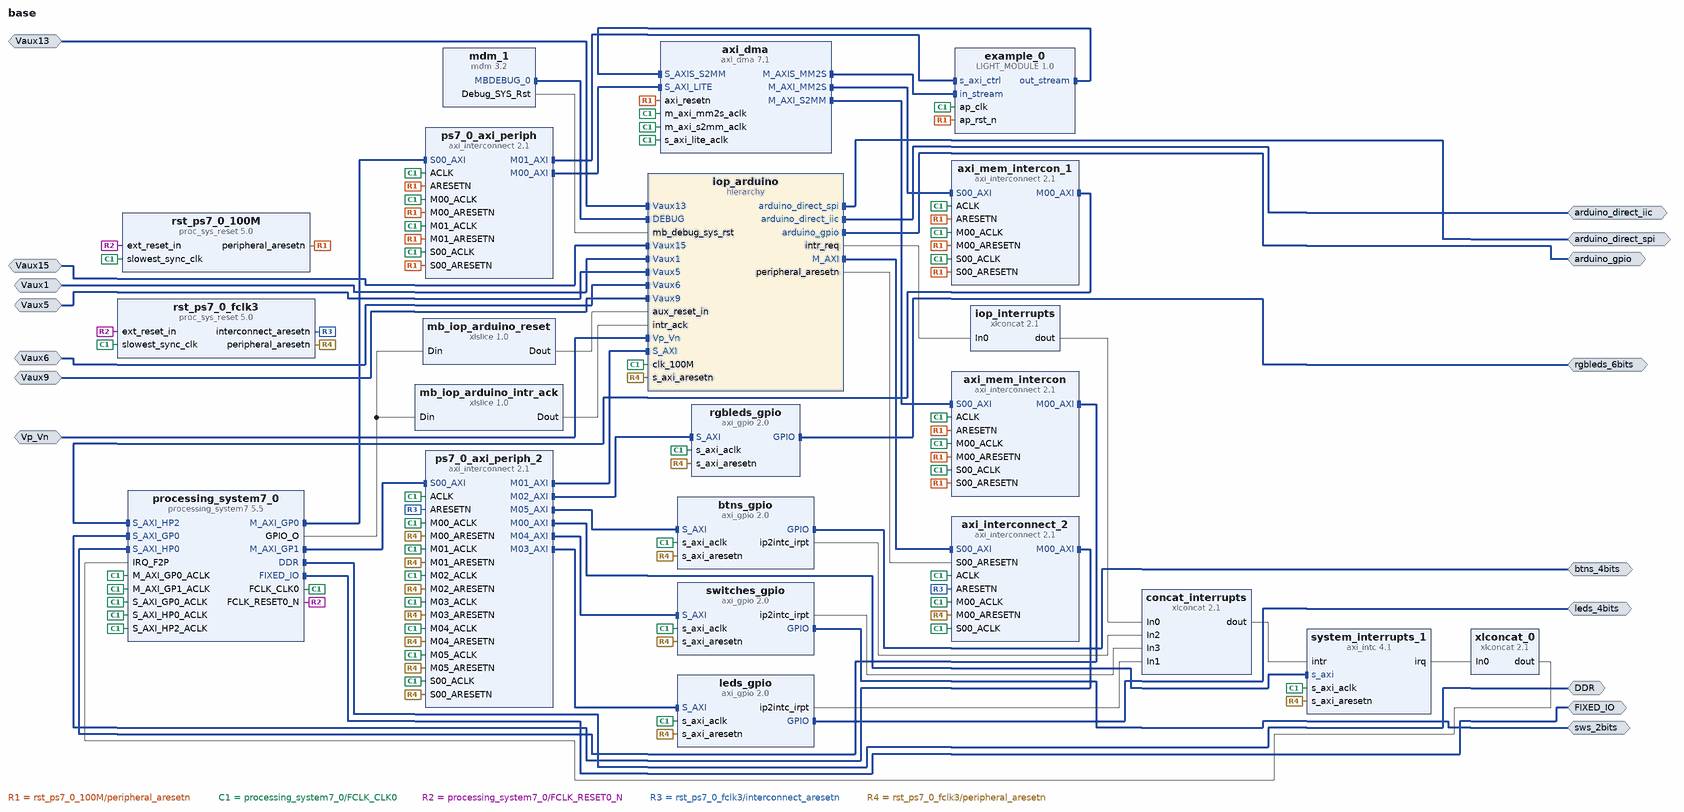
[diagram p0: block diagram of the top level]
# Vivado block design base, xc7z020clg400-1, Vivado 2023.1.1
create_bd_design base

create_bd_intf_port -mode Slave -vlnv xilinx.com:interface:diff_analog_io_rtl:1.0 Vaux1
create_bd_intf_port -mode Slave -vlnv xilinx.com:interface:diff_analog_io_rtl:1.0 Vaux5
create_bd_intf_port -mode Slave -vlnv xilinx.com:interface:diff_analog_io_rtl:1.0 Vaux6
create_bd_intf_port -mode Slave -vlnv xilinx.com:interface:diff_analog_io_rtl:1.0 Vaux9
create_bd_intf_port -mode Slave -vlnv xilinx.com:interface:diff_analog_io_rtl:1.0 Vaux13
create_bd_intf_port -mode Slave -vlnv xilinx.com:interface:diff_analog_io_rtl:1.0 Vaux15
create_bd_intf_port -mode Slave -vlnv xilinx.com:interface:diff_analog_io_rtl:1.0 Vp_Vn
create_bd_intf_port -mode Master -vlnv xilinx.com:interface:iic_rtl:1.0 arduino_direct_iic
create_bd_intf_port -mode Master -vlnv xilinx.com:interface:spi_rtl:1.0 arduino_direct_spi
create_bd_intf_port -mode Master -vlnv xilinx.com:interface:gpio_rtl:1.0 arduino_gpio
create_bd_intf_port -mode Master -vlnv xilinx.com:interface:gpio_rtl:1.0 btns_4bits
create_bd_intf_port -mode Master -vlnv xilinx.com:interface:gpio_rtl:1.0 leds_4bits
create_bd_intf_port -mode Master -vlnv xilinx.com:interface:gpio_rtl:1.0 rgbleds_6bits
create_bd_intf_port -mode Master -vlnv xilinx.com:interface:gpio_rtl:1.0 sws_2bits
create_bd_intf_port -mode Master -vlnv xilinx.com:interface:ddrx_rtl:1.0 DDR
create_bd_intf_port -mode Master -vlnv xilinx.com:display_processing_system7:fixedio_rtl:1.0 FIXED_IO

create_bd_cell -type ip -vlnv xilinx.com:ip:axi_interconnect:2.1 axi_interconnect_2
set_property -dict {CONFIG.NUM_MI 1 CONFIG.NUM_SI 1} [get_bd_cells axi_interconnect_2]
create_bd_cell -type ip -vlnv xilinx.com:ip:xlconcat:2.1 concat_interrupts
set_property -dict {CONFIG.NUM_PORTS 4} [get_bd_cells concat_interrupts]
create_bd_cell -type hier iop_arduino
create_bd_cell -type ip -vlnv xilinx.com:ip:xlconcat:2.1 iop_interrupts
set_property -dict {CONFIG.NUM_PORTS 1} [get_bd_cells iop_interrupts]
create_bd_cell -type ip -vlnv xilinx.com:ip:xlslice:1.0 mb_iop_arduino_intr_ack
set_property -dict [list \
  CONFIG.DIN_FROM 6 \
  CONFIG.DIN_TO 6 \
  CONFIG.DIN_WIDTH 10 \
  CONFIG.DOUT_WIDTH 1 \
] [get_bd_cells mb_iop_arduino_intr_ack]
create_bd_cell -type ip -vlnv xilinx.com:ip:xlslice:1.0 mb_iop_arduino_reset
set_property -dict {CONFIG.DIN_FROM 2 CONFIG.DIN_TO 2 CONFIG.DIN_WIDTH 10 CONFIG.DOUT_WIDTH 1} [get_bd_cells mb_iop_arduino_reset]
create_bd_cell -type ip -vlnv xilinx.com:ip:mdm:3.2 mdm_1
set_property -dict {CONFIG.C_ADDR_SIZE 32 CONFIG.C_MB_DBG_PORTS 1 CONFIG.C_M_AXI_ADDR_WIDTH 32} [get_bd_cells mdm_1]
create_bd_cell -type ip -vlnv xilinx.com:ip:axi_interconnect:2.1 ps7_0_axi_periph_2
set_property -dict [list \
  CONFIG.M00_HAS_REGSLICE 1 \
  CONFIG.M01_HAS_REGSLICE 1 \
  CONFIG.M02_HAS_REGSLICE 1 \
  CONFIG.M03_HAS_REGSLICE 1 \
  CONFIG.M04_HAS_REGSLICE 1 \
  CONFIG.M05_HAS_REGSLICE 1 \
  CONFIG.M06_HAS_REGSLICE 1 \
  CONFIG.M07_HAS_REGSLICE 1 \
  CONFIG.M08_HAS_REGSLICE 1 \
  CONFIG.M09_HAS_REGSLICE 1 \
  CONFIG.NUM_MI 6 \
  CONFIG.S00_HAS_REGSLICE 1 \
] [get_bd_cells ps7_0_axi_periph_2]
create_bd_cell -type ip -vlnv xilinx.com:ip:axi_intc:4.1 system_interrupts_1
create_bd_cell -type ip -vlnv xilinx.com:ip:xlconcat:2.1 xlconcat_0
set_property -dict {CONFIG.NUM_PORTS 16} [get_bd_cells xlconcat_0]
create_bd_cell -type ip -vlnv xilinx.com:ip:axi_dma:7.1 axi_dma
set_property -dict [list \
  CONFIG.c_include_sg 0 \
  CONFIG.c_m_axi_mm2s_data_width 64 \
  CONFIG.c_m_axis_mm2s_tdata_width 32 \
  CONFIG.c_mm2s_burst_size 16 \
  CONFIG.c_sg_length_width 26 \
] [get_bd_cells axi_dma]
create_bd_cell -type ip -vlnv xilinx.com:ip:axi_interconnect:2.1 axi_mem_intercon
set_property -dict {CONFIG.ENABLE_ADVANCED_OPTIONS 1 CONFIG.NUM_MI 1 CONFIG.XBAR_DATA_WIDTH 64} [get_bd_cells axi_mem_intercon]
create_bd_cell -type ip -vlnv xilinx.com:ip:axi_interconnect:2.1 axi_mem_intercon_1
set_property -dict {CONFIG.ENABLE_ADVANCED_OPTIONS 1 CONFIG.NUM_MI 1 CONFIG.XBAR_DATA_WIDTH 64} [get_bd_cells axi_mem_intercon_1]
create_bd_cell -type ip -vlnv xilinx.com:ip:axi_interconnect:2.1 ps7_0_axi_periph
set_property -dict {CONFIG.NUM_MI 2} [get_bd_cells ps7_0_axi_periph]
create_bd_cell -type ip -vlnv xilinx.com:ip:axi_gpio:2.0 btns_gpio
set_property -dict {CONFIG.C_ALL_INPUTS 1 CONFIG.C_GPIO_WIDTH 4 CONFIG.C_INTERRUPT_PRESENT 1} [get_bd_cells btns_gpio]
create_bd_cell -type ip -vlnv xilinx.com:ip:axi_gpio:2.0 leds_gpio
set_property -dict [list \
  CONFIG.C_ALL_OUTPUTS 1 \
  CONFIG.C_GPIO_WIDTH 4 \
  CONFIG.C_INTERRUPT_PRESENT 1 \
  CONFIG.C_IS_DUAL 0 \
] [get_bd_cells leds_gpio]
create_bd_cell -type ip -vlnv xilinx.com:ip:processing_system7:5.5 processing_system7_0
set_property -dict [list \
  CONFIG.PCW_APU_PERIPHERAL_FREQMHZ 650 \
  CONFIG.PCW_CRYSTAL_PERIPHERAL_FREQMHZ 50 \
  CONFIG.PCW_ENET0_ENET0_IO {MIO 16 .. 27} \
  CONFIG.PCW_ENET0_GRP_MDIO_ENABLE 1 \
  CONFIG.PCW_ENET0_GRP_MDIO_IO {MIO 52 .. 53} \
  CONFIG.PCW_ENET0_PERIPHERAL_ENABLE 1 \
  CONFIG.PCW_FPGA0_PERIPHERAL_FREQMHZ 100 \
  CONFIG.PCW_FPGA1_PERIPHERAL_FREQMHZ 142 \
  CONFIG.PCW_FPGA2_PERIPHERAL_FREQMHZ 200 \
  CONFIG.PCW_FPGA3_PERIPHERAL_FREQMHZ 100 \
  CONFIG.PCW_GPIO_EMIO_GPIO_ENABLE 1 \
  CONFIG.PCW_GPIO_EMIO_GPIO_IO 10 \
  CONFIG.PCW_GPIO_EMIO_GPIO_WIDTH 10 \
  CONFIG.PCW_GPIO_MIO_GPIO_ENABLE 0 \
  CONFIG.PCW_I2C0_GRP_INT_ENABLE 1 \
  CONFIG.PCW_I2C0_GRP_INT_IO EMIO \
  CONFIG.PCW_I2C0_I2C0_IO {MIO 50 .. 51} \
  CONFIG.PCW_I2C0_PERIPHERAL_ENABLE 1 \
  CONFIG.PCW_I2C_PERIPHERAL_FREQMHZ 108.333336 \
  CONFIG.PCW_IRQ_F2P_INTR 1 \
  CONFIG.PCW_PERIPHERAL_BOARD_PRESET None \
  CONFIG.PCW_PRESET_BANK1_VOLTAGE {LVCMOS 1.8V} \
  CONFIG.PCW_QSPI_GRP_FBCLK_ENABLE 1 \
  CONFIG.PCW_QSPI_GRP_FBCLK_IO {MIO 8} \
  CONFIG.PCW_QSPI_GRP_SINGLE_SS_ENABLE 1 \
  CONFIG.PCW_QSPI_GRP_SINGLE_SS_IO {MIO 1 .. 6} \
  CONFIG.PCW_QSPI_PERIPHERAL_ENABLE 1 \
  CONFIG.PCW_QSPI_QSPI_IO {MIO 1 .. 6} \
  CONFIG.PCW_SD0_GRP_CD_ENABLE 1 \
  CONFIG.PCW_SD0_GRP_CD_IO {MIO 47} \
  CONFIG.PCW_SD0_GRP_WP_ENABLE 0 \
  CONFIG.PCW_SD0_PERIPHERAL_ENABLE 1 \
  CONFIG.PCW_SD0_SD0_IO {MIO 40 .. 45} \
  CONFIG.PCW_SDIO_PERIPHERAL_FREQMHZ 50 \
  CONFIG.PCW_SINGLE_QSPI_DATA_MODE x4 \
  CONFIG.PCW_UART0_PERIPHERAL_ENABLE 1 \
  CONFIG.PCW_UART0_UART0_IO {MIO 14 .. 15} \
  CONFIG.PCW_UART1_PERIPHERAL_ENABLE 0 \
  CONFIG.PCW_UART_PERIPHERAL_FREQMHZ 100 \
  CONFIG.PCW_UIPARAM_DDR_BUS_WIDTH {16 Bit} \
  CONFIG.PCW_UIPARAM_DDR_FREQ_MHZ 525 \
  CONFIG.PCW_UIPARAM_DDR_PARTNO Custom \
  CONFIG.PCW_USB0_PERIPHERAL_ENABLE 0 \
  CONFIG.PCW_USE_FABRIC_INTERRUPT 1 \
  CONFIG.PCW_USE_M_AXI_GP1 1 \
  CONFIG.PCW_USE_S_AXI_GP0 1 \
  CONFIG.PCW_USE_S_AXI_HP0 1 \
  CONFIG.PCW_USE_S_AXI_HP2 1 \
] [get_bd_cells processing_system7_0]
# 451 more settings of processing_system7_0 are not shown: defaults, MIO pin electricals, DDR timing, and values the tool derives
create_bd_cell -type ip -vlnv xilinx.com:ip:axi_gpio:2.0 rgbleds_gpio
set_property -dict {CONFIG.C_ALL_OUTPUTS 1 CONFIG.C_GPIO_WIDTH 6} [get_bd_cells rgbleds_gpio]
create_bd_cell -type ip -vlnv xilinx.com:ip:proc_sys_reset:5.0 rst_ps7_0_100M
create_bd_cell -type ip -vlnv xilinx.com:ip:proc_sys_reset:5.0 rst_ps7_0_fclk3
create_bd_cell -type ip -vlnv xilinx.com:ip:axi_gpio:2.0 switches_gpio
set_property -dict [list \
  CONFIG.C_ALL_INPUTS 1 \
  CONFIG.C_GPIO_WIDTH 2 \
  CONFIG.C_INTERRUPT_PRESENT 1 \
  CONFIG.C_IS_DUAL 0 \
] [get_bd_cells switches_gpio]
create_bd_cell -type ip -vlnv xilinx.com:hls:LIGHT_MODULE:1.0 example_0

# ---- hierarchy /iop_arduino ----
current_bd_instance /iop_arduino
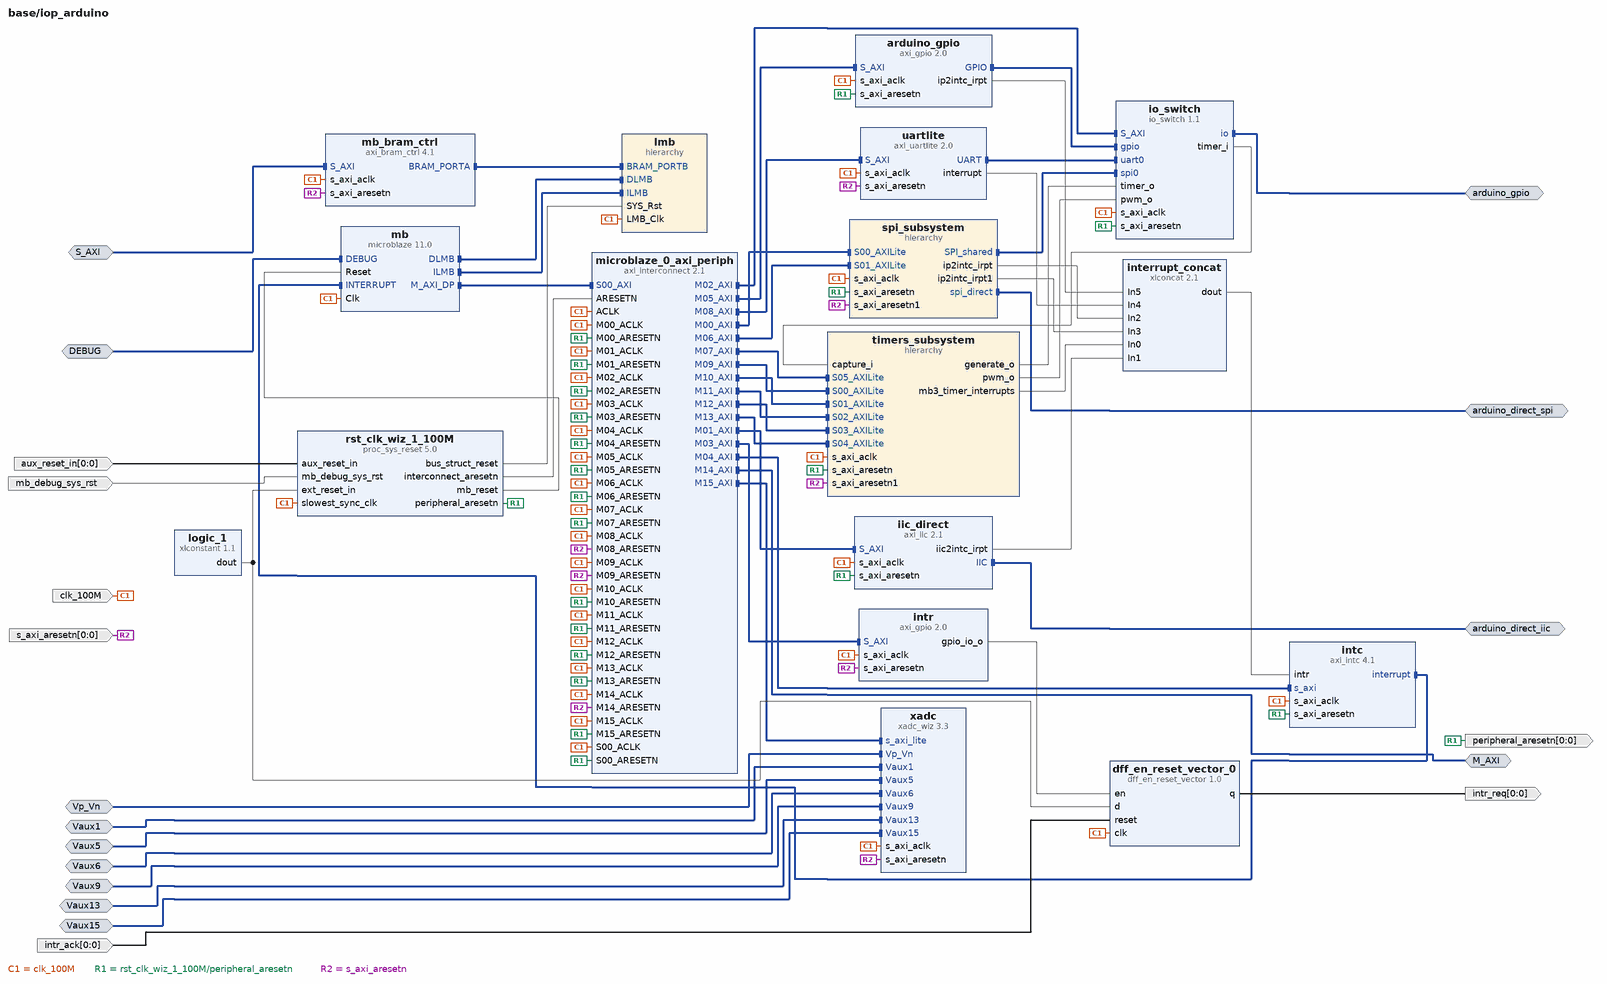
[diagram p1: block diagram inside /iop_arduino]
create_bd_intf_pin -mode Slave -vlnv xilinx.com:interface:mbdebug_rtl:3.0 DEBUG
create_bd_intf_pin -mode Slave -vlnv xilinx.com:interface:aximm_rtl:1.0 S_AXI
create_bd_intf_pin -mode Slave -vlnv xilinx.com:interface:diff_analog_io_rtl:1.0 Vaux1
create_bd_intf_pin -mode Slave -vlnv xilinx.com:interface:diff_analog_io_rtl:1.0 Vaux5
create_bd_intf_pin -mode Slave -vlnv xilinx.com:interface:diff_analog_io_rtl:1.0 Vaux6
create_bd_intf_pin -mode Slave -vlnv xilinx.com:interface:diff_analog_io_rtl:1.0 Vaux9
create_bd_intf_pin -mode Slave -vlnv xilinx.com:interface:diff_analog_io_rtl:1.0 Vaux13
create_bd_intf_pin -mode Slave -vlnv xilinx.com:interface:diff_analog_io_rtl:1.0 Vaux15
create_bd_intf_pin -mode Slave -vlnv xilinx.com:interface:diff_analog_io_rtl:1.0 Vp_Vn
create_bd_intf_pin -mode Master -vlnv xilinx.com:interface:iic_rtl:1.0 arduino_direct_iic
create_bd_intf_pin -mode Master -vlnv xilinx.com:interface:spi_rtl:1.0 arduino_direct_spi
create_bd_intf_pin -mode Master -vlnv xilinx.com:interface:gpio_rtl:1.0 arduino_gpio
create_bd_intf_pin -mode Master -vlnv xilinx.com:interface:aximm_rtl:1.0 M_AXI
create_bd_pin -dir I -from 0 -to 0 -type rst aux_reset_in
create_bd_pin -dir I -type clk clk_100M
create_bd_pin -dir I -from 0 -to 0 intr_ack
create_bd_pin -dir O -from 0 -to 0 intr_req
create_bd_pin -dir I -type rst mb_debug_sys_rst
create_bd_pin -dir O -from 0 -to 0 -type rst peripheral_aresetn
create_bd_pin -dir I -from 0 -to 0 -type rst s_axi_aresetn

create_bd_cell -type ip -vlnv xilinx.com:user:dff_en_reset_vector:1.0 dff_en_reset_vector_0
set_property -dict {CONFIG.SIZE 1} [get_bd_cells dff_en_reset_vector_0]
create_bd_cell -type ip -vlnv xilinx.com:ip:axi_intc:4.1 intc
create_bd_cell -type ip -vlnv xilinx.com:ip:xlconcat:2.1 interrupt_concat
set_property -dict {CONFIG.NUM_PORTS 6} [get_bd_cells interrupt_concat]
create_bd_cell -type ip -vlnv xilinx.com:user:io_switch:1.1 io_switch
set_property -dict [list \
  CONFIG.C_INTERFACE_TYPE 3 \
  CONFIG.C_IO_SWITCH_WIDTH 20 \
  CONFIG.I2C0_Enable false \
  CONFIG.PWM_Enable true \
  CONFIG.SPI0_Enable true \
  CONFIG.SPI1_Enable false \
  CONFIG.Timer_Enable true \
  CONFIG.UART0_Enable true \
] [get_bd_cells io_switch]
create_bd_cell -type hier lmb
create_bd_cell -type ip -vlnv xilinx.com:ip:xlconstant:1.1 logic_1
create_bd_cell -type ip -vlnv xilinx.com:ip:microblaze:11.0 mb
set_property -dict {CONFIG.C_DEBUG_ENABLED 1 CONFIG.C_D_AXI 1 CONFIG.C_D_LMB 1 CONFIG.C_I_LMB 1} [get_bd_cells mb]
create_bd_cell -type ip -vlnv xilinx.com:ip:axi_bram_ctrl:4.1 mb_bram_ctrl
set_property -dict {CONFIG.SINGLE_PORT_BRAM 1} [get_bd_cells mb_bram_ctrl]
create_bd_cell -type hier spi_subsystem
create_bd_cell -type hier timers_subsystem
create_bd_cell -type ip -vlnv xilinx.com:ip:xadc_wiz:3.3 xadc
set_property -dict [list \
  CONFIG.AVERAGE_ENABLE_TEMPERATURE true \
  CONFIG.AVERAGE_ENABLE_VAUXP0_VAUXN0 false \
  CONFIG.AVERAGE_ENABLE_VAUXP12_VAUXN12 false \
  CONFIG.AVERAGE_ENABLE_VAUXP13_VAUXN13 true \
  CONFIG.AVERAGE_ENABLE_VAUXP15_VAUXN15 true \
  CONFIG.AVERAGE_ENABLE_VAUXP1_VAUXN1 true \
  CONFIG.AVERAGE_ENABLE_VAUXP5_VAUXN5 true \
  CONFIG.AVERAGE_ENABLE_VAUXP6_VAUXN6 true \
  CONFIG.AVERAGE_ENABLE_VAUXP8_VAUXN8 false \
  CONFIG.AVERAGE_ENABLE_VAUXP9_VAUXN9 true \
  CONFIG.AVERAGE_ENABLE_VP_VN true \
  CONFIG.BIPOLAR_VAUXP0_VAUXN0 false \
  CONFIG.BIPOLAR_VAUXP12_VAUXN12 false \
  CONFIG.BIPOLAR_VAUXP8_VAUXN8 false \
  CONFIG.CHANNEL_AVERAGING 16 \
  CONFIG.CHANNEL_ENABLE_TEMPERATURE true \
  CONFIG.CHANNEL_ENABLE_VAUXP0_VAUXN0 false \
  CONFIG.CHANNEL_ENABLE_VAUXP12_VAUXN12 false \
  CONFIG.CHANNEL_ENABLE_VAUXP13_VAUXN13 true \
  CONFIG.CHANNEL_ENABLE_VAUXP15_VAUXN15 true \
  CONFIG.CHANNEL_ENABLE_VAUXP1_VAUXN1 true \
  CONFIG.CHANNEL_ENABLE_VAUXP5_VAUXN5 true \
  CONFIG.CHANNEL_ENABLE_VAUXP6_VAUXN6 true \
  CONFIG.CHANNEL_ENABLE_VAUXP8_VAUXN8 false \
  CONFIG.CHANNEL_ENABLE_VAUXP9_VAUXN9 true \
  CONFIG.CHANNEL_ENABLE_VP_VN true \
  CONFIG.CHANNEL_ENABLE_VREFN false \
  CONFIG.CHANNEL_ENABLE_VREFP false \
  CONFIG.ENABLE_RESET false \
  CONFIG.ENABLE_VCCDDRO_ALARM false \
  CONFIG.ENABLE_VCCPAUX_ALARM false \
  CONFIG.ENABLE_VCCPINT_ALARM false \
  CONFIG.EXTERNAL_MUX_CHANNEL VP_VN \
  CONFIG.INTERFACE_SELECTION Enable_AXI \
  CONFIG.OT_ALARM false \
  CONFIG.SEQUENCER_MODE Continuous \
  CONFIG.SINGLE_CHANNEL_SELECTION TEMPERATURE \
  CONFIG.USER_TEMP_ALARM false \
  CONFIG.VCCAUX_ALARM false \
  CONFIG.VCCINT_ALARM false \
  CONFIG.XADC_STARUP_SELECTION channel_sequencer \
] [get_bd_cells xadc]
create_bd_cell -type ip -vlnv xilinx.com:ip:axi_interconnect:2.1 microblaze_0_axi_periph
set_property -dict [list \
  CONFIG.M00_HAS_REGSLICE 1 \
  CONFIG.M01_HAS_REGSLICE 1 \
  CONFIG.M02_HAS_REGSLICE 1 \
  CONFIG.M03_HAS_REGSLICE 1 \
  CONFIG.M04_HAS_REGSLICE 1 \
  CONFIG.M05_HAS_REGSLICE 1 \
  CONFIG.M06_HAS_REGSLICE 1 \
  CONFIG.M07_HAS_REGSLICE 1 \
  CONFIG.M08_HAS_REGSLICE 1 \
  CONFIG.M09_HAS_REGSLICE 1 \
  CONFIG.M10_HAS_REGSLICE 1 \
  CONFIG.M11_HAS_REGSLICE 1 \
  CONFIG.M12_HAS_REGSLICE 1 \
  CONFIG.M13_HAS_REGSLICE 1 \
  CONFIG.M14_HAS_REGSLICE 1 \
  CONFIG.M15_HAS_REGSLICE 1 \
  CONFIG.M16_HAS_REGSLICE 1 \
  CONFIG.NUM_MI 16 \
  CONFIG.S00_HAS_REGSLICE 1 \
] [get_bd_cells microblaze_0_axi_periph]
create_bd_cell -type ip -vlnv xilinx.com:ip:axi_gpio:2.0 arduino_gpio
set_property -dict {CONFIG.C_GPIO_WIDTH 20 CONFIG.C_INTERRUPT_PRESENT 1 CONFIG.C_IS_DUAL 0} [get_bd_cells arduino_gpio]
create_bd_cell -type ip -vlnv xilinx.com:ip:axi_iic:2.1 iic_direct
create_bd_cell -type ip -vlnv xilinx.com:ip:axi_gpio:2.0 intr
set_property -dict {CONFIG.C_ALL_OUTPUTS 1 CONFIG.C_GPIO_WIDTH 1} [get_bd_cells intr]
create_bd_cell -type ip -vlnv xilinx.com:ip:proc_sys_reset:5.0 rst_clk_wiz_1_100M
set_property -dict {CONFIG.C_AUX_RESET_HIGH 1} [get_bd_cells rst_clk_wiz_1_100M]
create_bd_cell -type ip -vlnv xilinx.com:ip:axi_uartlite:2.0 uartlite
set_property -dict {CONFIG.C_BAUDRATE 9600} [get_bd_cells uartlite]

# ---- hierarchy /iop_arduino/lmb ----
current_bd_instance /iop_arduino/lmb
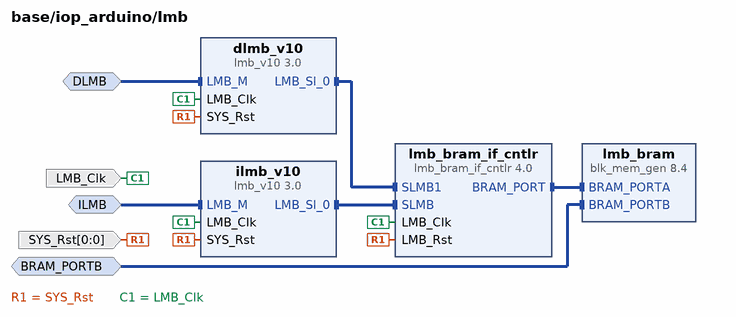
[diagram p2: block diagram inside /iop_arduino/lmb]
create_bd_intf_pin -mode Slave -vlnv xilinx.com:interface:bram_rtl:1.0 BRAM_PORTB
create_bd_intf_pin -mode MirroredMaster -vlnv xilinx.com:interface:lmb_rtl:1.0 DLMB
create_bd_intf_pin -mode MirroredMaster -vlnv xilinx.com:interface:lmb_rtl:1.0 ILMB
create_bd_pin -dir I -type clk LMB_Clk
create_bd_pin -dir I -from 0 -to 0 -type rst SYS_Rst

create_bd_cell -type ip -vlnv xilinx.com:ip:lmb_v10:3.0 dlmb_v10
create_bd_cell -type ip -vlnv xilinx.com:ip:lmb_v10:3.0 ilmb_v10
create_bd_cell -type ip -vlnv xilinx.com:ip:blk_mem_gen:8.4 lmb_bram
set_property -dict [list \
  CONFIG.Enable_B Use_ENB_Pin \
  CONFIG.Memory_Type True_Dual_Port_RAM \
  CONFIG.Port_B_Clock 100 \
  CONFIG.Port_B_Enable_Rate 100 \
  CONFIG.Port_B_Write_Rate 50 \
  CONFIG.Use_RSTB_Pin true \
  CONFIG.use_bram_block BRAM_Controller \
] [get_bd_cells lmb_bram]
create_bd_cell -type ip -vlnv xilinx.com:ip:lmb_bram_if_cntlr:4.0 lmb_bram_if_cntlr
set_property -dict {CONFIG.C_ECC 0 CONFIG.C_NUM_LMB 2} [get_bd_cells lmb_bram_if_cntlr]

# ---- hierarchy /iop_arduino/spi_subsystem ----
current_bd_instance /iop_arduino/spi_subsystem
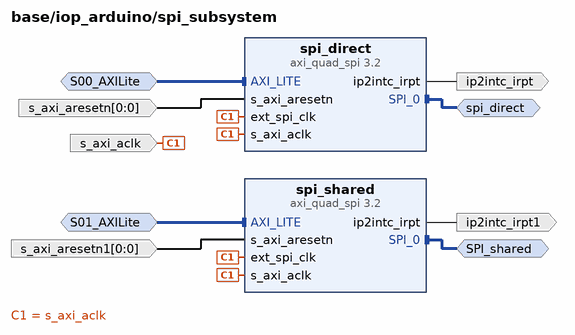
[diagram p3: block diagram inside /iop_arduino/spi_subsystem]
create_bd_intf_pin -mode Slave -vlnv xilinx.com:interface:aximm_rtl:1.0 S00_AXILite
create_bd_intf_pin -mode Slave -vlnv xilinx.com:interface:aximm_rtl:1.0 S01_AXILite
create_bd_intf_pin -mode Master -vlnv xilinx.com:interface:spi_rtl:1.0 SPI_shared
create_bd_intf_pin -mode Master -vlnv xilinx.com:interface:spi_rtl:1.0 spi_direct
create_bd_pin -dir O -type intr ip2intc_irpt
create_bd_pin -dir O -type intr ip2intc_irpt1
create_bd_pin -dir I -type clk s_axi_aclk
create_bd_pin -dir I -from 0 -to 0 -type rst s_axi_aresetn
create_bd_pin -dir I -from 0 -to 0 -type rst s_axi_aresetn1

create_bd_cell -type ip -vlnv xilinx.com:ip:axi_quad_spi:3.2 spi_direct
set_property -dict {CONFIG.C_USE_STARTUP 0} [get_bd_cells spi_direct]
create_bd_cell -type ip -vlnv xilinx.com:ip:axi_quad_spi:3.2 spi_shared
set_property -dict {CONFIG.C_USE_STARTUP 0} [get_bd_cells spi_shared]

# ---- hierarchy /iop_arduino/timers_subsystem ----
current_bd_instance /iop_arduino/timers_subsystem
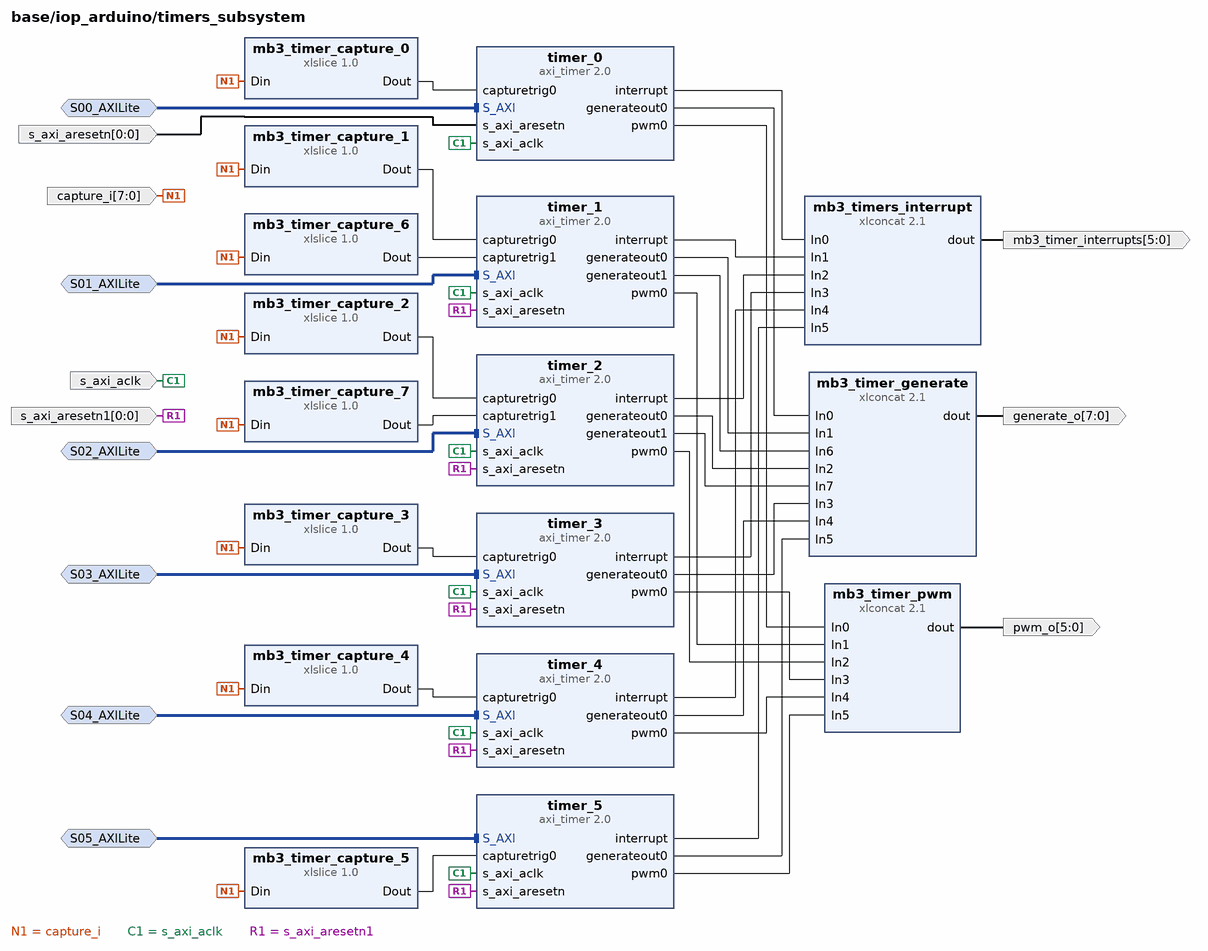
[diagram p4: block diagram inside /iop_arduino/timers_subsystem]
create_bd_intf_pin -mode Slave -vlnv xilinx.com:interface:aximm_rtl:1.0 S00_AXILite
create_bd_intf_pin -mode Slave -vlnv xilinx.com:interface:aximm_rtl:1.0 S01_AXILite
create_bd_intf_pin -mode Slave -vlnv xilinx.com:interface:aximm_rtl:1.0 S02_AXILite
create_bd_intf_pin -mode Slave -vlnv xilinx.com:interface:aximm_rtl:1.0 S03_AXILite
create_bd_intf_pin -mode Slave -vlnv xilinx.com:interface:aximm_rtl:1.0 S04_AXILite
create_bd_intf_pin -mode Slave -vlnv xilinx.com:interface:aximm_rtl:1.0 S05_AXILite
create_bd_pin -dir I -from 7 -to 0 capture_i
create_bd_pin -dir O -from 7 -to 0 generate_o
create_bd_pin -dir O -from 5 -to 0 mb3_timer_interrupts
create_bd_pin -dir O -from 5 -to 0 pwm_o
create_bd_pin -dir I -type clk s_axi_aclk
create_bd_pin -dir I -from 0 -to 0 -type rst s_axi_aresetn
create_bd_pin -dir I -from 0 -to 0 -type rst s_axi_aresetn1

create_bd_cell -type ip -vlnv xilinx.com:ip:xlslice:1.0 mb3_timer_capture_0
set_property -dict {CONFIG.DIN_FROM 0 CONFIG.DIN_TO 0 CONFIG.DIN_WIDTH 8} [get_bd_cells mb3_timer_capture_0]
create_bd_cell -type ip -vlnv xilinx.com:ip:xlslice:1.0 mb3_timer_capture_1
set_property -dict {CONFIG.DIN_FROM 1 CONFIG.DIN_TO 1 CONFIG.DIN_WIDTH 8 CONFIG.DOUT_WIDTH 1} [get_bd_cells mb3_timer_capture_1]
create_bd_cell -type ip -vlnv xilinx.com:ip:xlslice:1.0 mb3_timer_capture_2
set_property -dict {CONFIG.DIN_FROM 2 CONFIG.DIN_TO 2 CONFIG.DIN_WIDTH 8 CONFIG.DOUT_WIDTH 1} [get_bd_cells mb3_timer_capture_2]
create_bd_cell -type ip -vlnv xilinx.com:ip:xlslice:1.0 mb3_timer_capture_3
set_property -dict {CONFIG.DIN_FROM 3 CONFIG.DIN_TO 3 CONFIG.DIN_WIDTH 8 CONFIG.DOUT_WIDTH 1} [get_bd_cells mb3_timer_capture_3]
create_bd_cell -type ip -vlnv xilinx.com:ip:xlslice:1.0 mb3_timer_capture_4
set_property -dict {CONFIG.DIN_FROM 4 CONFIG.DIN_TO 4 CONFIG.DIN_WIDTH 8 CONFIG.DOUT_WIDTH 1} [get_bd_cells mb3_timer_capture_4]
create_bd_cell -type ip -vlnv xilinx.com:ip:xlslice:1.0 mb3_timer_capture_5
set_property -dict {CONFIG.DIN_FROM 5 CONFIG.DIN_TO 5 CONFIG.DIN_WIDTH 8 CONFIG.DOUT_WIDTH 1} [get_bd_cells mb3_timer_capture_5]
create_bd_cell -type ip -vlnv xilinx.com:ip:xlslice:1.0 mb3_timer_capture_6
set_property -dict {CONFIG.DIN_FROM 6 CONFIG.DIN_TO 6 CONFIG.DIN_WIDTH 8 CONFIG.DOUT_WIDTH 1} [get_bd_cells mb3_timer_capture_6]
create_bd_cell -type ip -vlnv xilinx.com:ip:xlslice:1.0 mb3_timer_capture_7
set_property -dict {CONFIG.DIN_FROM 7 CONFIG.DIN_TO 7 CONFIG.DIN_WIDTH 8 CONFIG.DOUT_WIDTH 1} [get_bd_cells mb3_timer_capture_7]
create_bd_cell -type ip -vlnv xilinx.com:ip:xlconcat:2.1 mb3_timer_generate
set_property -dict {CONFIG.NUM_PORTS 8} [get_bd_cells mb3_timer_generate]
create_bd_cell -type ip -vlnv xilinx.com:ip:xlconcat:2.1 mb3_timer_pwm
set_property -dict {CONFIG.NUM_PORTS 6} [get_bd_cells mb3_timer_pwm]
create_bd_cell -type ip -vlnv xilinx.com:ip:xlconcat:2.1 mb3_timers_interrupt
set_property -dict {CONFIG.NUM_PORTS 6} [get_bd_cells mb3_timers_interrupt]
create_bd_cell -type ip -vlnv xilinx.com:ip:axi_timer:2.0 timer_0
create_bd_cell -type ip -vlnv xilinx.com:ip:axi_timer:2.0 timer_1
create_bd_cell -type ip -vlnv xilinx.com:ip:axi_timer:2.0 timer_2
create_bd_cell -type ip -vlnv xilinx.com:ip:axi_timer:2.0 timer_3
create_bd_cell -type ip -vlnv xilinx.com:ip:axi_timer:2.0 timer_4
create_bd_cell -type ip -vlnv xilinx.com:ip:axi_timer:2.0 timer_5

# ---- connections ----

current_bd_instance /iop_arduino
connect_bd_intf_net [get_bd_intf_pins lmb/BRAM_PORTB] [get_bd_intf_pins mb_bram_ctrl/BRAM_PORTA]
connect_bd_intf_net [get_bd_intf_pins arduino_direct_iic] [get_bd_intf_pins iic_direct/IIC]
connect_bd_intf_net [get_bd_intf_pins S_AXI] [get_bd_intf_pins mb_bram_ctrl/S_AXI]
connect_bd_intf_net [get_bd_intf_pins arduino_gpio] [get_bd_intf_pins io_switch/io]
connect_bd_intf_net [get_bd_intf_pins Vp_Vn] [get_bd_intf_pins xadc/Vp_Vn]
connect_bd_intf_net [get_bd_intf_pins Vaux1] [get_bd_intf_pins xadc/Vaux1]
connect_bd_intf_net [get_bd_intf_pins Vaux5] [get_bd_intf_pins xadc/Vaux5]
connect_bd_intf_net [get_bd_intf_pins Vaux6] [get_bd_intf_pins xadc/Vaux6]
connect_bd_intf_net [get_bd_intf_pins Vaux9] [get_bd_intf_pins xadc/Vaux9]
connect_bd_intf_net [get_bd_intf_pins Vaux13] [get_bd_intf_pins xadc/Vaux13]
connect_bd_intf_net [get_bd_intf_pins Vaux15] [get_bd_intf_pins xadc/Vaux15]
connect_bd_intf_net [get_bd_intf_pins arduino_gpio/GPIO] [get_bd_intf_pins io_switch/gpio]
connect_bd_intf_net -intf_net mb3_intc_interrupt [get_bd_intf_pins intc/interrupt] [get_bd_intf_pins mb/INTERRUPT]
connect_bd_intf_net -intf_net mb3_spi_subsystem_spi_sw_shield [get_bd_intf_pins arduino_direct_spi] [get_bd_intf_pins spi_subsystem/spi_direct]
connect_bd_intf_net -intf_net microblaze_0_M_AXI_DP [get_bd_intf_pins mb/M_AXI_DP] [get_bd_intf_pins microblaze_0_axi_periph/S00_AXI]
connect_bd_intf_net [get_bd_intf_pins microblaze_0_axi_periph/M00_AXI] [get_bd_intf_pins spi_subsystem/S00_AXILite]
connect_bd_intf_net [get_bd_intf_pins iic_direct/S_AXI] [get_bd_intf_pins microblaze_0_axi_periph/M01_AXI]
connect_bd_intf_net [get_bd_intf_pins io_switch/S_AXI] [get_bd_intf_pins microblaze_0_axi_periph/M02_AXI]
connect_bd_intf_net [get_bd_intf_pins intr/S_AXI] [get_bd_intf_pins microblaze_0_axi_periph/M03_AXI]
connect_bd_intf_net [get_bd_intf_pins intc/s_axi] [get_bd_intf_pins microblaze_0_axi_periph/M04_AXI]
connect_bd_intf_net [get_bd_intf_pins arduino_gpio/S_AXI] [get_bd_intf_pins microblaze_0_axi_periph/M05_AXI]
connect_bd_intf_net [get_bd_intf_pins microblaze_0_axi_periph/M06_AXI] [get_bd_intf_pins spi_subsystem/S01_AXILite]
connect_bd_intf_net [get_bd_intf_pins microblaze_0_axi_periph/M07_AXI] [get_bd_intf_pins timers_subsystem/S05_AXILite]
connect_bd_intf_net [get_bd_intf_pins microblaze_0_axi_periph/M08_AXI] [get_bd_intf_pins uartlite/S_AXI]
connect_bd_intf_net [get_bd_intf_pins microblaze_0_axi_periph/M09_AXI] [get_bd_intf_pins timers_subsystem/S00_AXILite]
connect_bd_intf_net [get_bd_intf_pins microblaze_0_axi_periph/M10_AXI] [get_bd_intf_pins timers_subsystem/S01_AXILite]
connect_bd_intf_net [get_bd_intf_pins microblaze_0_axi_periph/M11_AXI] [get_bd_intf_pins timers_subsystem/S02_AXILite]
connect_bd_intf_net [get_bd_intf_pins microblaze_0_axi_periph/M12_AXI] [get_bd_intf_pins timers_subsystem/S03_AXILite]
connect_bd_intf_net [get_bd_intf_pins microblaze_0_axi_periph/M13_AXI] [get_bd_intf_pins timers_subsystem/S04_AXILite]
connect_bd_intf_net [get_bd_intf_pins M_AXI] [get_bd_intf_pins microblaze_0_axi_periph/M14_AXI]
connect_bd_intf_net [get_bd_intf_pins microblaze_0_axi_periph/M15_AXI] [get_bd_intf_pins xadc/s_axi_lite]
connect_bd_intf_net -intf_net microblaze_0_debug [get_bd_intf_pins DEBUG] [get_bd_intf_pins mb/DEBUG]
connect_bd_intf_net -intf_net microblaze_0_dlmb_1 [get_bd_intf_pins lmb/DLMB] [get_bd_intf_pins mb/DLMB]
connect_bd_intf_net -intf_net microblaze_0_ilmb_1 [get_bd_intf_pins lmb/ILMB] [get_bd_intf_pins mb/ILMB]
connect_bd_intf_net -intf_net spi_subsystem_SPI_0 [get_bd_intf_pins io_switch/spi0] [get_bd_intf_pins spi_subsystem/SPI_shared]
connect_bd_intf_net [get_bd_intf_pins io_switch/uart0] [get_bd_intf_pins uartlite/UART]
connect_bd_net -net capture_i_1 [get_bd_pins io_switch/timer_i] [get_bd_pins timers_subsystem/capture_i]
connect_bd_net [get_bd_pins dff_en_reset_vector_0/q] [get_bd_pins intr_req]
connect_bd_net [get_bd_pins logic_1/dout] [get_bd_pins dff_en_reset_vector_0/d] [get_bd_pins rst_clk_wiz_1_100M/ext_reset_in]
connect_bd_net -net mb3_concat_dout [get_bd_pins interrupt_concat/dout] [get_bd_pins intc/intr]
connect_bd_net -net mb3_gpio_subsystem_ip2intc_irpt [get_bd_pins arduino_gpio/ip2intc_irpt] [get_bd_pins interrupt_concat/In5]
connect_bd_net -net mb3_iic_subsystem_iic2intc_irpt [get_bd_pins iic_direct/iic2intc_irpt] [get_bd_pins interrupt_concat/In1]
connect_bd_net -net mb3_intr_ack_1 [get_bd_pins intr_ack] [get_bd_pins dff_en_reset_vector_0/reset]
connect_bd_net -net mb3_intr_gpio_io_o [get_bd_pins intr/gpio_io_o] [get_bd_pins dff_en_reset_vector_0/en]
connect_bd_net -net mb3_spi_subsystem_ip2intc_irpt [get_bd_pins spi_subsystem/ip2intc_irpt] [get_bd_pins interrupt_concat/In2]
connect_bd_net -net mb3_spi_subsystem_ip2intc_irpt1 [get_bd_pins spi_subsystem/ip2intc_irpt1] [get_bd_pins interrupt_concat/In3]
connect_bd_net -net mb3_timers_subsystem_mb3_timer_interrupts [get_bd_pins timers_subsystem/mb3_timer_interrupts] [get_bd_pins interrupt_concat/In0]
connect_bd_net -net mb3_uartlite_interrupt [get_bd_pins uartlite/interrupt] [get_bd_pins interrupt_concat/In4]
connect_bd_net -net mb_1_reset_Dout [get_bd_pins aux_reset_in] [get_bd_pins rst_clk_wiz_1_100M/aux_reset_in]
connect_bd_net -net mdm_1_debug_sys_rst [get_bd_pins mb_debug_sys_rst] [get_bd_pins rst_clk_wiz_1_100M/mb_debug_sys_rst]
connect_bd_net -net ps7_0_FCLK_CLK0 [get_bd_pins clk_100M] \
  [get_bd_pins dff_en_reset_vector_0/clk] [get_bd_pins intc/s_axi_aclk] [get_bd_pins io_switch/s_axi_aclk] \
  [get_bd_pins lmb/LMB_Clk] [get_bd_pins mb/Clk] [get_bd_pins mb_bram_ctrl/s_axi_aclk] [get_bd_pins spi_subsystem/s_axi_aclk] \
  [get_bd_pins timers_subsystem/s_axi_aclk] [get_bd_pins xadc/s_axi_aclk] [get_bd_pins microblaze_0_axi_periph/ACLK] \
  [get_bd_pins microblaze_0_axi_periph/S00_ACLK] [get_bd_pins microblaze_0_axi_periph/M15_ACLK] \
  [get_bd_pins microblaze_0_axi_periph/M14_ACLK] [get_bd_pins microblaze_0_axi_periph/M13_ACLK] \
  [get_bd_pins microblaze_0_axi_periph/M12_ACLK] [get_bd_pins microblaze_0_axi_periph/M11_ACLK] \
  [get_bd_pins microblaze_0_axi_periph/M10_ACLK] [get_bd_pins microblaze_0_axi_periph/M09_ACLK] \
  [get_bd_pins microblaze_0_axi_periph/M08_ACLK] [get_bd_pins microblaze_0_axi_periph/M07_ACLK] \
  [get_bd_pins microblaze_0_axi_periph/M06_ACLK] [get_bd_pins microblaze_0_axi_periph/M05_ACLK] \
  [get_bd_pins microblaze_0_axi_periph/M04_ACLK] [get_bd_pins microblaze_0_axi_periph/M03_ACLK] \
  [get_bd_pins microblaze_0_axi_periph/M02_ACLK] [get_bd_pins microblaze_0_axi_periph/M01_ACLK] \
  [get_bd_pins microblaze_0_axi_periph/M00_ACLK] [get_bd_pins arduino_gpio/s_axi_aclk] [get_bd_pins iic_direct/s_axi_aclk] \
  [get_bd_pins intr/s_axi_aclk] [get_bd_pins rst_clk_wiz_1_100M/slowest_sync_clk] [get_bd_pins uartlite/s_axi_aclk]
connect_bd_net [get_bd_pins rst_clk_wiz_1_100M/bus_struct_reset] [get_bd_pins lmb/SYS_Rst]
connect_bd_net [get_bd_pins rst_clk_wiz_1_100M/interconnect_aresetn] [get_bd_pins microblaze_0_axi_periph/ARESETN]
connect_bd_net [get_bd_pins rst_clk_wiz_1_100M/mb_reset] [get_bd_pins mb/Reset]
connect_bd_net [get_bd_pins rst_clk_wiz_1_100M/peripheral_aresetn] \
  [get_bd_pins peripheral_aresetn] [get_bd_pins intc/s_axi_aresetn] [get_bd_pins io_switch/s_axi_aresetn] \
  [get_bd_pins spi_subsystem/s_axi_aresetn] [get_bd_pins timers_subsystem/s_axi_aresetn] \
  [get_bd_pins microblaze_0_axi_periph/S00_ARESETN] [get_bd_pins microblaze_0_axi_periph/M15_ARESETN] \
  [get_bd_pins microblaze_0_axi_periph/M13_ARESETN] [get_bd_pins microblaze_0_axi_periph/M12_ARESETN] \
  [get_bd_pins microblaze_0_axi_periph/M11_ARESETN] [get_bd_pins microblaze_0_axi_periph/M10_ARESETN] \
  [get_bd_pins microblaze_0_axi_periph/M07_ARESETN] [get_bd_pins microblaze_0_axi_periph/M06_ARESETN] \
  [get_bd_pins microblaze_0_axi_periph/M05_ARESETN] [get_bd_pins microblaze_0_axi_periph/M04_ARESETN] \
  [get_bd_pins microblaze_0_axi_periph/M03_ARESETN] [get_bd_pins microblaze_0_axi_periph/M02_ARESETN] \
  [get_bd_pins microblaze_0_axi_periph/M01_ARESETN] [get_bd_pins microblaze_0_axi_periph/M00_ARESETN] \
  [get_bd_pins arduino_gpio/s_axi_aresetn] [get_bd_pins iic_direct/s_axi_aresetn]
connect_bd_net [get_bd_pins s_axi_aresetn] \
  [get_bd_pins mb_bram_ctrl/s_axi_aresetn] [get_bd_pins spi_subsystem/s_axi_aresetn1] \
  [get_bd_pins timers_subsystem/s_axi_aresetn1] [get_bd_pins xadc/s_axi_aresetn] \
  [get_bd_pins microblaze_0_axi_periph/M08_ARESETN] [get_bd_pins microblaze_0_axi_periph/M14_ARESETN] \
  [get_bd_pins microblaze_0_axi_periph/M09_ARESETN] [get_bd_pins intr/s_axi_aresetn] [get_bd_pins uartlite/s_axi_aresetn]
connect_bd_net [get_bd_pins timers_subsystem/generate_o] [get_bd_pins io_switch/timer_o]
connect_bd_net [get_bd_pins timers_subsystem/pwm_o] [get_bd_pins io_switch/pwm_o]
set_property HDL_ATTRIBUTE.BMM_INFO_PROCESSOR {microblaze-le > base iop_arduino/lmb/lmb_bram_if_cntlr} [get_bd_cells mb]
set_property HDL_ATTRIBUTE.KEEP_HIERARCHY yes [get_bd_cells mb]
set_property HDL_ATTRIBUTE.BMM_INFO_ADDRESS_SPACE {byte  0x80000000 32 > base iop_arduino/lmb/lmb_bram} [get_bd_cells mb_bram_ctrl]
set_property HDL_ATTRIBUTE.KEEP_HIERARCHY yes [get_bd_cells mb_bram_ctrl]

current_bd_instance /iop_arduino/lmb
connect_bd_intf_net [get_bd_intf_pins dlmb_v10/LMB_Sl_0] [get_bd_intf_pins lmb_bram_if_cntlr/SLMB1]
connect_bd_intf_net [get_bd_intf_pins BRAM_PORTB] [get_bd_intf_pins lmb_bram/BRAM_PORTB]
connect_bd_intf_net [get_bd_intf_pins lmb_bram/BRAM_PORTA] [get_bd_intf_pins lmb_bram_if_cntlr/BRAM_PORT]
connect_bd_intf_net -intf_net microblaze_0_dlmb [get_bd_intf_pins DLMB] [get_bd_intf_pins dlmb_v10/LMB_M]
connect_bd_intf_net -intf_net microblaze_0_ilmb [get_bd_intf_pins ILMB] [get_bd_intf_pins ilmb_v10/LMB_M]
connect_bd_intf_net -intf_net microblaze_0_ilmb_bus [get_bd_intf_pins ilmb_v10/LMB_Sl_0] [get_bd_intf_pins lmb_bram_if_cntlr/SLMB]
connect_bd_net [get_bd_pins SYS_Rst] [get_bd_pins dlmb_v10/SYS_Rst] [get_bd_pins ilmb_v10/SYS_Rst] [get_bd_pins lmb_bram_if_cntlr/LMB_Rst]
connect_bd_net -net microblaze_0_Clk [get_bd_pins LMB_Clk] \
  [get_bd_pins dlmb_v10/LMB_Clk] [get_bd_pins ilmb_v10/LMB_Clk] [get_bd_pins lmb_bram_if_cntlr/LMB_Clk]
set_property HDL_ATTRIBUTE.BMM_INFO_ADDRESS_SPACE {byte  0x00000000 32 > base iop_arduino/lmb/lmb_bram} [get_bd_cells lmb_bram_if_cntlr]
set_property HDL_ATTRIBUTE.KEEP_HIERARCHY yes [get_bd_cells lmb_bram_if_cntlr]

current_bd_instance /iop_arduino/spi_subsystem
connect_bd_intf_net [get_bd_intf_pins spi_direct] [get_bd_intf_pins spi_direct/SPI_0]
connect_bd_intf_net [get_bd_intf_pins SPI_shared] [get_bd_intf_pins spi_shared/SPI_0]
connect_bd_intf_net [get_bd_intf_pins S00_AXILite] [get_bd_intf_pins spi_direct/AXI_LITE]
connect_bd_intf_net [get_bd_intf_pins S01_AXILite] [get_bd_intf_pins spi_shared/AXI_LITE]
connect_bd_net -net mb3_spi_ip2intc_irpt [get_bd_pins spi_direct/ip2intc_irpt] [get_bd_pins ip2intc_irpt]
connect_bd_net -net mb3_spi_pl_sw_d13_d10_ip2intc_irpt [get_bd_pins spi_shared/ip2intc_irpt] [get_bd_pins ip2intc_irpt1]
connect_bd_net -net ps7_0_FCLK_CLK0 [get_bd_pins s_axi_aclk] \
  [get_bd_pins spi_direct/ext_spi_clk] [get_bd_pins spi_direct/s_axi_aclk] [get_bd_pins spi_shared/ext_spi_clk] \
  [get_bd_pins spi_shared/s_axi_aclk]
connect_bd_net -net rst_clk_wiz_1_100M_peripheral_aresetn [get_bd_pins s_axi_aresetn] [get_bd_pins spi_direct/s_axi_aresetn]
connect_bd_net [get_bd_pins s_axi_aresetn1] [get_bd_pins spi_shared/s_axi_aresetn]

current_bd_instance /iop_arduino/timers_subsystem
connect_bd_intf_net [get_bd_intf_pins S05_AXILite] [get_bd_intf_pins timer_5/S_AXI]
connect_bd_intf_net [get_bd_intf_pins S00_AXILite] [get_bd_intf_pins timer_0/S_AXI]
connect_bd_intf_net [get_bd_intf_pins S01_AXILite] [get_bd_intf_pins timer_1/S_AXI]
connect_bd_intf_net [get_bd_intf_pins S02_AXILite] [get_bd_intf_pins timer_2/S_AXI]
connect_bd_intf_net [get_bd_intf_pins S03_AXILite] [get_bd_intf_pins timer_3/S_AXI]
connect_bd_intf_net [get_bd_intf_pins S04_AXILite] [get_bd_intf_pins timer_4/S_AXI]
connect_bd_net -net arduino_io_switch_0_timer_i_in [get_bd_pins capture_i] \
  [get_bd_pins mb3_timer_capture_0/Din] [get_bd_pins mb3_timer_capture_1/Din] [get_bd_pins mb3_timer_capture_2/Din] \
  [get_bd_pins mb3_timer_capture_3/Din] [get_bd_pins mb3_timer_capture_4/Din] [get_bd_pins mb3_timer_capture_5/Din] \
  [get_bd_pins mb3_timer_capture_6/Din] [get_bd_pins mb3_timer_capture_7/Din]
connect_bd_net -net mb3_timer_0_generateout0 [get_bd_pins timer_0/generateout0] [get_bd_pins mb3_timer_generate/In0]
connect_bd_net -net mb3_timer_0_interrupt [get_bd_pins timer_0/interrupt] [get_bd_pins mb3_timers_interrupt/In0]
connect_bd_net -net mb3_timer_0_pwm0 [get_bd_pins timer_0/pwm0] [get_bd_pins mb3_timer_pwm/In0]
connect_bd_net -net mb3_timer_1_generateout0 [get_bd_pins timer_1/generateout0] [get_bd_pins mb3_timer_generate/In1]
connect_bd_net -net mb3_timer_1_interrupt [get_bd_pins timer_1/interrupt] [get_bd_pins mb3_timers_interrupt/In1]
connect_bd_net -net mb3_timer_1_pwm0 [get_bd_pins timer_1/pwm0] [get_bd_pins mb3_timer_pwm/In1]
connect_bd_net -net mb3_timer_2_generateout0 [get_bd_pins timer_2/generateout0] [get_bd_pins mb3_timer_generate/In2]
connect_bd_net -net mb3_timer_2_interrupt [get_bd_pins timer_2/interrupt] [get_bd_pins mb3_timers_interrupt/In2]
connect_bd_net -net mb3_timer_2_pwm0 [get_bd_pins timer_2/pwm0] [get_bd_pins mb3_timer_pwm/In2]
connect_bd_net -net mb3_timer_3_generateout0 [get_bd_pins timer_3/generateout0] [get_bd_pins mb3_timer_generate/In3]
connect_bd_net -net mb3_timer_3_interrupt [get_bd_pins timer_3/interrupt] [get_bd_pins mb3_timers_interrupt/In3]
connect_bd_net -net mb3_timer_3_pwm0 [get_bd_pins timer_3/pwm0] [get_bd_pins mb3_timer_pwm/In3]
connect_bd_net -net mb3_timer_4_generateout0 [get_bd_pins timer_4/generateout0] [get_bd_pins mb3_timer_generate/In4]
connect_bd_net -net mb3_timer_4_interrupt [get_bd_pins timer_4/interrupt] [get_bd_pins mb3_timers_interrupt/In4]
connect_bd_net -net mb3_timer_4_pwm0 [get_bd_pins timer_4/pwm0] [get_bd_pins mb3_timer_pwm/In4]
connect_bd_net -net mb3_timer_5_generateout0 [get_bd_pins timer_5/generateout0] [get_bd_pins mb3_timer_generate/In5]
connect_bd_net -net mb3_timer_5_interrupt [get_bd_pins timer_5/interrupt] [get_bd_pins mb3_timers_interrupt/In5]
connect_bd_net -net mb3_timer_5_pwm0 [get_bd_pins timer_5/pwm0] [get_bd_pins mb3_timer_pwm/In5]
connect_bd_net [get_bd_pins mb3_timer_capture_0/Dout] [get_bd_pins timer_0/capturetrig0]
connect_bd_net [get_bd_pins mb3_timer_capture_1/Dout] [get_bd_pins timer_1/capturetrig0]
connect_bd_net [get_bd_pins mb3_timer_capture_2/Dout] [get_bd_pins timer_2/capturetrig0]
connect_bd_net [get_bd_pins mb3_timer_capture_3/Dout] [get_bd_pins timer_3/capturetrig0]
connect_bd_net [get_bd_pins mb3_timer_capture_4/Dout] [get_bd_pins timer_4/capturetrig0]
connect_bd_net [get_bd_pins mb3_timer_capture_5/Dout] [get_bd_pins timer_5/capturetrig0]
connect_bd_net [get_bd_pins mb3_timer_capture_6/Dout] [get_bd_pins timer_1/capturetrig1]
connect_bd_net [get_bd_pins mb3_timer_capture_7/Dout] [get_bd_pins timer_2/capturetrig1]
connect_bd_net [get_bd_pins mb3_timer_generate/dout] [get_bd_pins generate_o]
connect_bd_net [get_bd_pins mb3_timer_pwm/dout] [get_bd_pins pwm_o]
connect_bd_net [get_bd_pins mb3_timers_interrupt/dout] [get_bd_pins mb3_timer_interrupts]
connect_bd_net -net ps7_0_FCLK_CLK0 [get_bd_pins s_axi_aclk] \
  [get_bd_pins timer_0/s_axi_aclk] [get_bd_pins timer_1/s_axi_aclk] [get_bd_pins timer_2/s_axi_aclk] \
  [get_bd_pins timer_3/s_axi_aclk] [get_bd_pins timer_4/s_axi_aclk] [get_bd_pins timer_5/s_axi_aclk]
connect_bd_net -net rst_clk_wiz_1_100M_peripheral_aresetn [get_bd_pins s_axi_aresetn] [get_bd_pins timer_0/s_axi_aresetn]
connect_bd_net [get_bd_pins s_axi_aresetn1] \
  [get_bd_pins timer_1/s_axi_aresetn] [get_bd_pins timer_2/s_axi_aresetn] [get_bd_pins timer_3/s_axi_aresetn] \
  [get_bd_pins timer_4/s_axi_aresetn] [get_bd_pins timer_5/s_axi_aresetn]
connect_bd_net [get_bd_pins timer_1/generateout1] [get_bd_pins mb3_timer_generate/In6]
connect_bd_net [get_bd_pins timer_2/generateout1] [get_bd_pins mb3_timer_generate/In7]

current_bd_instance /
connect_bd_intf_net [get_bd_intf_pins iop_arduino/DEBUG] [get_bd_intf_pins mdm_1/MBDEBUG_0]
connect_bd_intf_net -intf_net Vaux13_1 [get_bd_intf_ports Vaux13] [get_bd_intf_pins iop_arduino/Vaux13]
connect_bd_intf_net -intf_net Vaux15_1 [get_bd_intf_ports Vaux15] [get_bd_intf_pins iop_arduino/Vaux15]
connect_bd_intf_net -intf_net Vaux1_1 [get_bd_intf_ports Vaux1] [get_bd_intf_pins iop_arduino/Vaux1]
connect_bd_intf_net -intf_net Vaux5_1 [get_bd_intf_ports Vaux5] [get_bd_intf_pins iop_arduino/Vaux5]
connect_bd_intf_net -intf_net Vaux6_1 [get_bd_intf_ports Vaux6] [get_bd_intf_pins iop_arduino/Vaux6]
connect_bd_intf_net -intf_net Vaux9_1 [get_bd_intf_ports Vaux9] [get_bd_intf_pins iop_arduino/Vaux9]
connect_bd_intf_net [get_bd_intf_ports Vp_Vn] [get_bd_intf_pins iop_arduino/Vp_Vn]
connect_bd_intf_net [get_bd_intf_pins axi_dma/M_AXIS_MM2S] [get_bd_intf_pins example_0/in_stream]
connect_bd_intf_net [get_bd_intf_pins axi_dma/M_AXI_MM2S] [get_bd_intf_pins axi_mem_intercon_1/S00_AXI]
connect_bd_intf_net [get_bd_intf_pins axi_dma/M_AXI_S2MM] [get_bd_intf_pins axi_mem_intercon/S00_AXI]
connect_bd_intf_net [get_bd_intf_pins axi_interconnect_2/M00_AXI] [get_bd_intf_pins processing_system7_0/S_AXI_GP0]
connect_bd_intf_net [get_bd_intf_pins axi_mem_intercon_1/M00_AXI] [get_bd_intf_pins processing_system7_0/S_AXI_HP2]
connect_bd_intf_net [get_bd_intf_pins axi_mem_intercon/M00_AXI] [get_bd_intf_pins processing_system7_0/S_AXI_HP0]
connect_bd_intf_net [get_bd_intf_ports btns_4bits] [get_bd_intf_pins btns_gpio/GPIO]
connect_bd_intf_net [get_bd_intf_pins axi_dma/S_AXIS_S2MM] [get_bd_intf_pins example_0/out_stream]
connect_bd_intf_net -intf_net iop3_spi_sw_shield [get_bd_intf_ports arduino_direct_spi] [get_bd_intf_pins iop_arduino/arduino_direct_spi]
connect_bd_intf_net -intf_net iop_arduino_IIC_0 [get_bd_intf_ports arduino_direct_iic] [get_bd_intf_pins iop_arduino/arduino_direct_iic]
connect_bd_intf_net [get_bd_intf_pins iop_arduino/M_AXI] [get_bd_intf_pins axi_interconnect_2/S00_AXI]
connect_bd_intf_net [get_bd_intf_ports arduino_gpio] [get_bd_intf_pins iop_arduino/arduino_gpio]
connect_bd_intf_net [get_bd_intf_ports leds_4bits] [get_bd_intf_pins leds_gpio/GPIO]
connect_bd_intf_net [get_bd_intf_ports DDR] [get_bd_intf_pins processing_system7_0/DDR]
connect_bd_intf_net [get_bd_intf_ports FIXED_IO] [get_bd_intf_pins processing_system7_0/FIXED_IO]
connect_bd_intf_net [get_bd_intf_pins processing_system7_0/M_AXI_GP0] [get_bd_intf_pins ps7_0_axi_periph/S00_AXI]
connect_bd_intf_net [get_bd_intf_pins processing_system7_0/M_AXI_GP1] [get_bd_intf_pins ps7_0_axi_periph_2/S00_AXI]
connect_bd_intf_net [get_bd_intf_pins ps7_0_axi_periph_2/M01_AXI] [get_bd_intf_pins iop_arduino/S_AXI]
connect_bd_intf_net [get_bd_intf_pins leds_gpio/S_AXI] [get_bd_intf_pins ps7_0_axi_periph_2/M03_AXI]
connect_bd_intf_net [get_bd_intf_pins ps7_0_axi_periph_2/M00_AXI] [get_bd_intf_pins system_interrupts_1/s_axi]
connect_bd_intf_net [get_bd_intf_pins ps7_0_axi_periph/M00_AXI] [get_bd_intf_pins axi_dma/S_AXI_LITE]
connect_bd_intf_net [get_bd_intf_pins ps7_0_axi_periph/M01_AXI] [get_bd_intf_pins example_0/s_axi_ctrl]
connect_bd_intf_net [get_bd_intf_pins ps7_0_axi_periph_2/M02_AXI] [get_bd_intf_pins rgbleds_gpio/S_AXI]
connect_bd_intf_net [get_bd_intf_pins ps7_0_axi_periph_2/M04_AXI] [get_bd_intf_pins switches_gpio/S_AXI]
connect_bd_intf_net [get_bd_intf_pins btns_gpio/S_AXI] [get_bd_intf_pins ps7_0_axi_periph_2/M05_AXI]
connect_bd_intf_net -intf_net rgbled_gpio_GPIO [get_bd_intf_ports rgbleds_6bits] [get_bd_intf_pins rgbleds_gpio/GPIO]
connect_bd_intf_net -intf_net swsleds_gpio_GPIO [get_bd_intf_ports sws_2bits] [get_bd_intf_pins switches_gpio/GPIO]
connect_bd_net -net ARESETN_1 [get_bd_pins rst_ps7_0_100M/peripheral_aresetn] \
  [get_bd_pins ps7_0_axi_periph/ARESETN] [get_bd_pins ps7_0_axi_periph/S00_ARESETN] \
  [get_bd_pins ps7_0_axi_periph/M01_ARESETN] [get_bd_pins ps7_0_axi_periph/M00_ARESETN] \
  [get_bd_pins axi_mem_intercon/ARESETN] [get_bd_pins axi_mem_intercon/S00_ARESETN] \
  [get_bd_pins axi_mem_intercon/M00_ARESETN] [get_bd_pins axi_mem_intercon_1/ARESETN] \
  [get_bd_pins axi_mem_intercon_1/S00_ARESETN] [get_bd_pins axi_mem_intercon_1/M00_ARESETN] [get_bd_pins axi_dma/axi_resetn] \
  [get_bd_pins example_0/ap_rst_n]
connect_bd_net [get_bd_pins btns_gpio/ip2intc_irpt] [get_bd_pins concat_interrupts/In2]
connect_bd_net [get_bd_pins concat_interrupts/dout] [get_bd_pins system_interrupts_1/intr]
connect_bd_net [get_bd_pins iop_arduino/intr_req] [get_bd_pins iop_interrupts/In0]
connect_bd_net [get_bd_pins iop_arduino/peripheral_aresetn] [get_bd_pins axi_interconnect_2/S00_ARESETN]
connect_bd_net [get_bd_pins iop_interrupts/dout] [get_bd_pins concat_interrupts/In0]
connect_bd_net [get_bd_pins leds_gpio/ip2intc_irpt] [get_bd_pins concat_interrupts/In1]
connect_bd_net -net mb3_intr_ack_1 [get_bd_pins mb_iop_arduino_intr_ack/Dout] [get_bd_pins iop_arduino/intr_ack]
connect_bd_net -net mb_3_reset_Dout [get_bd_pins mb_iop_arduino_reset/Dout] [get_bd_pins iop_arduino/aux_reset_in]
connect_bd_net [get_bd_pins mdm_1/Debug_SYS_Rst] [get_bd_pins iop_arduino/mb_debug_sys_rst]
connect_bd_net [get_bd_pins processing_system7_0/FCLK_CLK0] \
  [get_bd_pins axi_dma/s_axi_lite_aclk] [get_bd_pins axi_dma/m_axi_mm2s_aclk] [get_bd_pins axi_dma/m_axi_s2mm_aclk] \
  [get_bd_pins axi_mem_intercon/S00_ACLK] [get_bd_pins axi_mem_intercon/M00_ACLK] [get_bd_pins axi_mem_intercon/ACLK] \
  [get_bd_pins axi_mem_intercon_1/S00_ACLK] [get_bd_pins axi_mem_intercon_1/ACLK] [get_bd_pins axi_mem_intercon_1/M00_ACLK] \
  [get_bd_pins ps7_0_axi_periph/ACLK] [get_bd_pins ps7_0_axi_periph/S00_ACLK] [get_bd_pins ps7_0_axi_periph/M00_ACLK] \
  [get_bd_pins ps7_0_axi_periph/M01_ACLK] [get_bd_pins axi_interconnect_2/ACLK] [get_bd_pins axi_interconnect_2/M00_ACLK] \
  [get_bd_pins axi_interconnect_2/S00_ACLK] [get_bd_pins iop_arduino/clk_100M] [get_bd_pins ps7_0_axi_periph_2/ACLK] \
  [get_bd_pins ps7_0_axi_periph_2/M00_ACLK] [get_bd_pins ps7_0_axi_periph_2/M01_ACLK] \
  [get_bd_pins ps7_0_axi_periph_2/M02_ACLK] [get_bd_pins ps7_0_axi_periph_2/M03_ACLK] \
  [get_bd_pins ps7_0_axi_periph_2/M04_ACLK] [get_bd_pins ps7_0_axi_periph_2/M05_ACLK] \
  [get_bd_pins ps7_0_axi_periph_2/S00_ACLK] [get_bd_pins system_interrupts_1/s_axi_aclk] [get_bd_pins btns_gpio/s_axi_aclk] \
  [get_bd_pins leds_gpio/s_axi_aclk] [get_bd_pins processing_system7_0/M_AXI_GP0_ACLK] \
  [get_bd_pins processing_system7_0/M_AXI_GP1_ACLK] [get_bd_pins processing_system7_0/S_AXI_GP0_ACLK] \
  [get_bd_pins processing_system7_0/S_AXI_HP2_ACLK] [get_bd_pins rgbleds_gpio/s_axi_aclk] \
  [get_bd_pins rst_ps7_0_100M/slowest_sync_clk] [get_bd_pins rst_ps7_0_fclk3/slowest_sync_clk] \
  [get_bd_pins switches_gpio/s_axi_aclk] [get_bd_pins example_0/ap_clk] [get_bd_pins processing_system7_0/S_AXI_HP0_ACLK]
connect_bd_net [get_bd_pins processing_system7_0/FCLK_RESET0_N] [get_bd_pins rst_ps7_0_100M/ext_reset_in] [get_bd_pins rst_ps7_0_fclk3/ext_reset_in]
connect_bd_net -net ps7_0_GPIO_O [get_bd_pins processing_system7_0/GPIO_O] \
  [get_bd_pins mb_iop_arduino_intr_ack/Din] [get_bd_pins mb_iop_arduino_reset/Din]
connect_bd_net -net rst_ps7_0_fclk0_interconnect_aresetn [get_bd_pins rst_ps7_0_fclk3/interconnect_aresetn] \
  [get_bd_pins axi_interconnect_2/ARESETN] [get_bd_pins ps7_0_axi_periph_2/ARESETN]
connect_bd_net -net rst_ps7_0_fclk0_peripheral_aresetn [get_bd_pins rst_ps7_0_fclk3/peripheral_aresetn] \
  [get_bd_pins axi_interconnect_2/M00_ARESETN] [get_bd_pins iop_arduino/s_axi_aresetn] \
  [get_bd_pins ps7_0_axi_periph_2/M00_ARESETN] [get_bd_pins ps7_0_axi_periph_2/M01_ARESETN] \
  [get_bd_pins ps7_0_axi_periph_2/M02_ARESETN] [get_bd_pins ps7_0_axi_periph_2/M03_ARESETN] \
  [get_bd_pins ps7_0_axi_periph_2/M04_ARESETN] [get_bd_pins ps7_0_axi_periph_2/M05_ARESETN] \
  [get_bd_pins ps7_0_axi_periph_2/S00_ARESETN] [get_bd_pins system_interrupts_1/s_axi_aresetn] \
  [get_bd_pins btns_gpio/s_axi_aresetn] [get_bd_pins leds_gpio/s_axi_aresetn] [get_bd_pins rgbleds_gpio/s_axi_aresetn] \
  [get_bd_pins switches_gpio/s_axi_aresetn]
connect_bd_net [get_bd_pins switches_gpio/ip2intc_irpt] [get_bd_pins concat_interrupts/In3]
connect_bd_net -net system_interrupts_irq [get_bd_pins system_interrupts_1/irq] [get_bd_pins xlconcat_0/In0]
connect_bd_net [get_bd_pins xlconcat_0/dout] [get_bd_pins processing_system7_0/IRQ_F2P]
set_property PFM.IRQ {In1 {} In2 {} In3 {} In4 {} In5 {} In6 {} In7 {} In8 {} In9 {} In10 {} In11 {} In12 {} In13 {} In14 {} In15 {}} [get_bd_cells xlconcat_0]
set_property HDL_ATTRIBUTE.BMM_INFO_PROCESSOR {arm > base iop_arduino/mb_bram_ctrl} [get_bd_cells processing_system7_0]
set_property HDL_ATTRIBUTE.KEEP_HIERARCHY yes [get_bd_cells processing_system7_0]

# ---- address map ----
assign_bd_address -offset 0x00000000 -range 512M -target_address_space [get_bd_addr_spaces axi_dma/Data_MM2S] [get_bd_addr_segs processing_system7_0/S_AXI_HP2/HP2_DDR_LOWOCM]
assign_bd_address -offset 0x00000000 -range 512M -target_address_space [get_bd_addr_spaces axi_dma/Data_S2MM] [get_bd_addr_segs processing_system7_0/S_AXI_HP0/HP0_DDR_LOWOCM]
assign_bd_address -offset 0x00000000 -range 64K -target_address_space [get_bd_addr_spaces iop_arduino/mb/Data] [get_bd_addr_segs iop_arduino/lmb/lmb_bram_if_cntlr/SLMB1/Mem]
assign_bd_address -offset 0x10000000 -range 256M -target_address_space [get_bd_addr_spaces iop_arduino/mb/Data] [get_bd_addr_segs processing_system7_0/S_AXI_GP0/GP0_DDR_LOWOCM]
assign_bd_address -offset 0x40010000 -range 64K -target_address_space [get_bd_addr_spaces iop_arduino/mb/Data] [get_bd_addr_segs iop_arduino/intr/S_AXI/Reg]
assign_bd_address -offset 0x40020000 -range 64K -target_address_space [get_bd_addr_spaces iop_arduino/mb/Data] [get_bd_addr_segs iop_arduino/arduino_gpio/S_AXI/Reg]
assign_bd_address -offset 0x40600000 -range 64K -target_address_space [get_bd_addr_spaces iop_arduino/mb/Data] [get_bd_addr_segs iop_arduino/uartlite/S_AXI/Reg]
assign_bd_address -offset 0x40800000 -range 64K -target_address_space [get_bd_addr_spaces iop_arduino/mb/Data] [get_bd_addr_segs iop_arduino/iic_direct/S_AXI/Reg]
assign_bd_address -offset 0x41200000 -range 64K -target_address_space [get_bd_addr_spaces iop_arduino/mb/Data] [get_bd_addr_segs iop_arduino/intc/S_AXI/Reg]
assign_bd_address -offset 0x41C00000 -range 64K -target_address_space [get_bd_addr_spaces iop_arduino/mb/Data] [get_bd_addr_segs iop_arduino/timers_subsystem/timer_0/S_AXI/Reg]
assign_bd_address -offset 0x41C10000 -range 64K -target_address_space [get_bd_addr_spaces iop_arduino/mb/Data] [get_bd_addr_segs iop_arduino/timers_subsystem/timer_1/S_AXI/Reg]
assign_bd_address -offset 0x41C20000 -range 64K -target_address_space [get_bd_addr_spaces iop_arduino/mb/Data] [get_bd_addr_segs iop_arduino/timers_subsystem/timer_2/S_AXI/Reg]
assign_bd_address -offset 0x41C30000 -range 64K -target_address_space [get_bd_addr_spaces iop_arduino/mb/Data] [get_bd_addr_segs iop_arduino/timers_subsystem/timer_3/S_AXI/Reg]
assign_bd_address -offset 0x41C40000 -range 64K -target_address_space [get_bd_addr_spaces iop_arduino/mb/Data] [get_bd_addr_segs iop_arduino/timers_subsystem/timer_4/S_AXI/Reg]
assign_bd_address -offset 0x41C50000 -range 64K -target_address_space [get_bd_addr_spaces iop_arduino/mb/Data] [get_bd_addr_segs iop_arduino/timers_subsystem/timer_5/S_AXI/Reg]
assign_bd_address -offset 0x42000000 -range 32M -target_address_space [get_bd_addr_spaces iop_arduino/mb/Data] [get_bd_addr_segs processing_system7_0/S_AXI_GP0/GP0_M_AXI_GP0]
assign_bd_address -offset 0x44A00000 -range 64K -target_address_space [get_bd_addr_spaces iop_arduino/mb/Data] [get_bd_addr_segs iop_arduino/spi_subsystem/spi_shared/AXI_LITE/Reg]
assign_bd_address -offset 0x44A10000 -range 64K -target_address_space [get_bd_addr_spaces iop_arduino/mb/Data] [get_bd_addr_segs iop_arduino/spi_subsystem/spi_direct/AXI_LITE/Reg]
assign_bd_address -offset 0x44A20000 -range 64K -target_address_space [get_bd_addr_spaces iop_arduino/mb/Data] [get_bd_addr_segs iop_arduino/io_switch/S_AXI/S_AXI_reg]
assign_bd_address -offset 0x44A30000 -range 64K -target_address_space [get_bd_addr_spaces iop_arduino/mb/Data] [get_bd_addr_segs iop_arduino/xadc/s_axi_lite/Reg]
assign_bd_address -offset 0x80000000 -range 1G -target_address_space [get_bd_addr_spaces iop_arduino/mb/Data] [get_bd_addr_segs processing_system7_0/S_AXI_GP0/GP0_M_AXI_GP1]
assign_bd_address -offset 0xE0000000 -range 4M -target_address_space [get_bd_addr_spaces iop_arduino/mb/Data] [get_bd_addr_segs processing_system7_0/S_AXI_GP0/GP0_IOP]
assign_bd_address -offset 0xFC000000 -range 16M -target_address_space [get_bd_addr_spaces iop_arduino/mb/Data] [get_bd_addr_segs processing_system7_0/S_AXI_GP0/GP0_QSPI_LINEAR]
assign_bd_address -offset 0x00000000 -range 64K -target_address_space [get_bd_addr_spaces iop_arduino/mb/Instruction] [get_bd_addr_segs iop_arduino/lmb/lmb_bram_if_cntlr/SLMB/Mem]
assign_bd_address -offset 0x40000000 -range 64K -target_address_space [get_bd_addr_spaces processing_system7_0/Data] [get_bd_addr_segs example_0/s_axi_ctrl/Reg]
assign_bd_address -offset 0x41E00000 -range 64K -target_address_space [get_bd_addr_spaces processing_system7_0/Data] [get_bd_addr_segs axi_dma/S_AXI_LITE/Reg]
assign_bd_address -offset 0x80000000 -range 64K -target_address_space [get_bd_addr_spaces processing_system7_0/Data] [get_bd_addr_segs iop_arduino/mb_bram_ctrl/S_AXI/Mem0]
assign_bd_address -offset 0x80010000 -range 64K -target_address_space [get_bd_addr_spaces processing_system7_0/Data] [get_bd_addr_segs btns_gpio/S_AXI/Reg]
assign_bd_address -offset 0x80020000 -range 64K -target_address_space [get_bd_addr_spaces processing_system7_0/Data] [get_bd_addr_segs leds_gpio/S_AXI/Reg]
assign_bd_address -offset 0x80030000 -range 64K -target_address_space [get_bd_addr_spaces processing_system7_0/Data] [get_bd_addr_segs rgbleds_gpio/S_AXI/Reg]
assign_bd_address -offset 0x80040000 -range 64K -target_address_space [get_bd_addr_spaces processing_system7_0/Data] [get_bd_addr_segs switches_gpio/S_AXI/Reg]
assign_bd_address -offset 0x81200000 -range 64K -target_address_space [get_bd_addr_spaces processing_system7_0/Data] [get_bd_addr_segs system_interrupts_1/S_AXI/Reg]

validate_bd_design
save_bd_design
